# EAGLE design pwm audio (EAGLE 7.7.0)
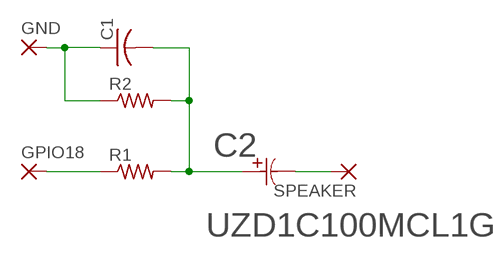
[diagram p0: schematic, sheet 1]

## Parts
C1  C-USC1206  [C1206]
C2  UZD1C100MCL1GB  [PCAP_5X3-ELECT]
GND  2,54/1,0  [2,54/1,0]
GPIO18  2,54/1,0  [2,54/1,0]
R1  R-US_R1206  [R1206]
R2  R-US_R1206  [R1206]
SPEAKER  2,54/1,0  [2,54/1,0]

## Nets
GND: C1.1 GND.1(P) R2.1
N$2: C1.2 C2.1 R1.2 R2.2
N$4: GPIO18.1(P) R1.1
N$5: C2.2 SPEAKER.1(P)

## Library data of the parts
C1 = rcl:C-US: CAPACITOR, American symbol
C2 = ELECTROLYTICCAP:UZD1C100MCL1GB; COPYRIGHT: Copyright (C) 2015 Accelerated Designs. All rights reserved; MANUFACTURER_PART_NUMBER: UZD1C100MCL1GB; VENDOR: Nichicon
GND GPIO18 SPEAKER = wirepad:2,54/1,0: THROUGH-HOLE PAD
R1 R2 = resistor:R-US_: RESISTOR, American symbol

## Board
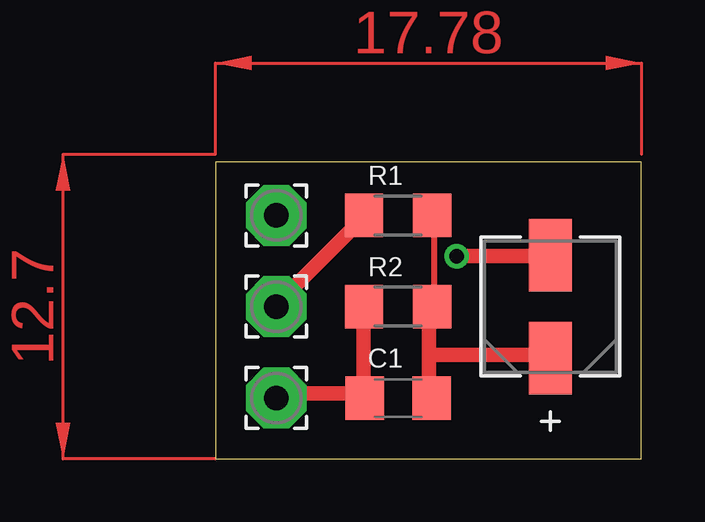
[diagram p1: board, top side]
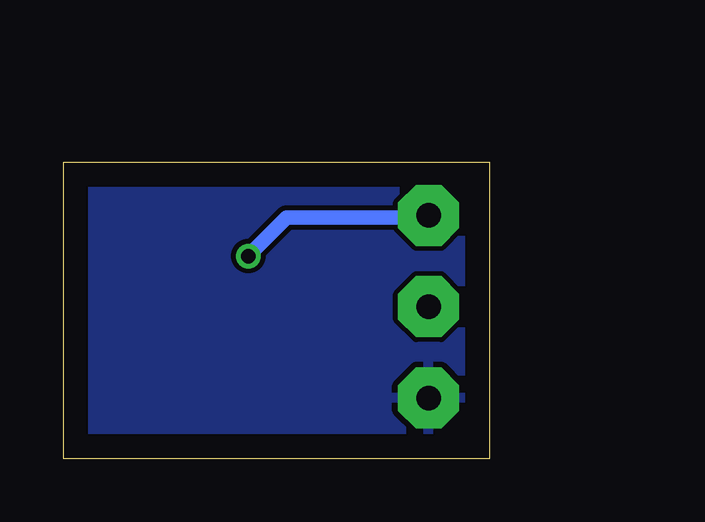
[diagram p2: board, bottom side, seen from below]

Size 17.76 x 12.37 mm. Coordinates in mm from the lower left corner, seen from the top.
Outline: 0,0 17.76,0 17.76,12.37 0,12.37 0,0
Copper layers (1*16): Top 0.035mm / dielectric 1.5mm / Bottom 0.035mm
Design rules "default": minimum track width 10mil, minimum drill 24mil, track to track 8mil, track to pad 8mil, pad to pad 8mil, via to via 8mil, smd to smd 8mil, copper to edge 40mil, drill to drill 8mil, minimum pad ring 10mil, minimum via ring 8mil, stop-mask expansion 4mil, vias tented up to drill 0mil, thermal gap 10mil

### Footprints (pad centres in the part's own frame; a part is rotated, then mirrored left to right if it is on the bottom)
C1206 = smd 1.6 x 1.8: 1 -1.4,0; 2 1.4,0
PCAP_5X3-ELECT = smd 3.023 x 1.803: 1 -2.146,0; 2 2.146,0
2,54/1,0 = drill 1.016 pad 2.54 octagon: 1 0,0
R1206 = smd 1.6 x 1.803: 1 -1.422,0; 2 1.422,0

### Placement (x,y rotation side)
C1  7.62,2.54 0 top
C2  13.97,6.35 90 top
GND  2.54,2.54 0 top
GPIO18  2.54,6.35 0 top
R1  7.62,10.16 0 top
R2  7.62,6.35 0 top
SPEAKER  2.54,10.16 0 top

### Tracks (layer width: path | path; a pad name or v marks a point on that pad's centre or on a via)
GND
  Top 0.254: 6.17,6.17 R2.1 | 6.17,2.74 C1.1
  Top 0.61: GND.1 2.74,2.74 6.17,2.74 6.17,6.17
  pour Bottom: 0,0 17.78,0 17.78,12.7 0,12.7
N$2
  Top 0.254: 8.91,2.74 C1.2 | 8.91,6.17 R2.2 9.14,6.4 9.14,10.06 R1.2 | 13.95,4.34 C2.1
  Top 0.61: 8.91,6.17 8.91,4.34 | 8.91,4.34 8.91,2.74 | 8.91,4.34 13.95,4.34
N$4
  Top 0.254: 6.17,10.06 R1.1
  Top 0.61: 6.17,10.06 2.52,6.4 GPIO18.1
N$5  (via drill 0.61)
  Top 0.254: 13.95,8.46 C2.2
  Top 0.61: v10.06,8.46 13.95,8.46
  Bottom 0.61: v10.06,8.46 8.46,10.06 2.74,10.06 SPEAKER.1
(copper drawn outside any net)
  shapes: Top area x2

### Text on the board
bValues: SPKR | GPIO18 | R1 270 / R2 150 / C1 .033uf / C2 10uf | GND